# Altium schematic sheet Bluetooth.SchDoc
size A4
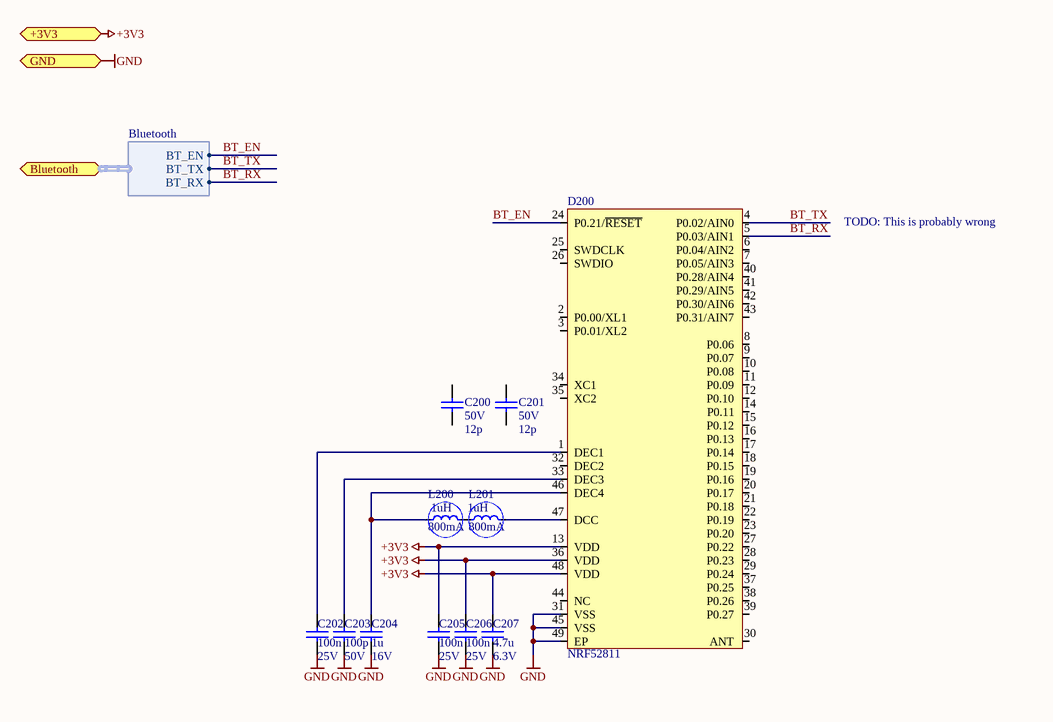
[diagram p0: Bluetooth.SchDoc]

## Parts
C200  value 12p  Value2: 50V  [SMD_CAP_0402]  (hidden comment: C_SMD_CER_12P_50V_2%_NP0_0402)
C201  value 12p  Value2: 50V  [SMD_CAP_0402]  (hidden comment: C_SMD_CER_12P_50V_2%_NP0_0402)
C202  value 100n  Value2: 25V  [SMD_CAP_0402]  (hidden comment: C_SMD_CER_100N_25V_10%_X7R_0402)
C203  value 100p  Value2: 50V  [SMD_CAP_0402]  (hidden comment: C_SMD_CER_100P_50V_5%_NP0_0402)
C204  value 1u  Value2: 16V  [SMD_CAP_0603]  (hidden comment: C_SMD_CER_1U_16V_10%_X7R_0603)
C205  value 100n  Value2: 25V  [SMD_CAP_0402]  (hidden comment: C_SMD_CER_100N_25V_10%_X7R_0402)
C206  value 100n  Value2: 25V  [SMD_CAP_0402]  (hidden comment: C_SMD_CER_100N_25V_10%_X7R_0402)
C207  value 4.7u  Value2: 6.3V  [SMD_CAP_0603]  (hidden comment: C_SMD_CER_4U7_6V3_10%_X5R_0603)
D200  Type: NRF52811  [SMD_VQFN-48_0.4_EP]  (hidden comment: D_NRF52811_VQFN-48)
L200  value 1uH  Value2: 800mA  [SMD_IND_1812]  (hidden comment: L_SMD_AIR_SHIELD_1U_0A8_20%_1812)
L201  value 1uH  Value2: 800mA  [SMD_IND_1812]  (hidden comment: L_SMD_AIR_SHIELD_1U_0A8_20%_1812)

## Ports
+3V3, Bluetooth (harness Bluetooth), GND

## Harnesses
Bluetooth: BT_TX, BT_RX, BT_EN

## Nets
+3V3: C205.2 C206.2 C207.2 D200.13(VDD) D200.36(VDD) D200.48(VDD) ; port +3V3
GND: C202.1 C203.1 C204.1 C205.1 C206.1 C207.1 D200.31(VSS) D200.45(VSS) D200.49(EP) ; port GND
BT_EN: D200.24(P0.21/~{RESET}) ; port Bluetooth.BT_EN
BT_RX: D200.5(P0.03/AIN1) ; port Bluetooth.BT_RX
BT_TX: D200.4(P0.02/AIN0) ; port Bluetooth.BT_TX
NetC202_2: C202.2 D200.1(DEC1)
NetC203_2: C203.2 D200.33(DEC3)
NetC204_2: C204.2 D200.46(DEC4) L200.1
NetD200_47: D200.47(DCC) L201.2
NetL200_2: L200.2 L201.1

Not connected (* = marked no-connect by the designer): C200 1 2; C201 1 2; D200 2(P0.00/XL1) 3(P0.01/XL2) 6(P0.04/AIN2) 7(P0.05/AIN3) 8(P0.06) 9(P0.07) 10(P0.08) 11(P0.09) 12(P0.10) 14(P0.11) 15(P0.12) 16(P0.13) 17(P0.14) 18(P0.15) 19(P0.16) 20(P0.17) 21(P0.18) 22(P0.19) 23(P0.20) 25(SWDCLK) 26(SWDIO) 27(P0.22) 28(P0.23) 29(P0.24) 30(ANT) 32(DEC2) 34(XC1) 35(XC2) 37(P0.25) 38(P0.26) 39(P0.27) 40(P0.28/AIN4) 41(P0.29/AIN5) 42(P0.30/AIN6) 43(P0.31/AIN7) 44(NC)

## Notes on the sheet
- TODO: This is probably wrong
- Title
- Size:
- Date:
- A4
- Number:
- Time:
- Revision:
- Sheet
- of
- File:

## Library data of the parts
C200 C201 = C_SMD_CER_12P_50V_2%_NP0_0402: 12pF ±2% 50V Ceramic Capacitor C0G, NP0 0402 (1005 Metric); Supplier - Digikey: 490-6197-1-ND
C202 C205 C206 = C_SMD_CER_100N_25V_10%_X7R_0402: 0.1µF ±10% 25V Ceramic Capacitor X7R 0402 (1005 Metric); Supplier - Digikey: 490-14603-1-ND
C204 = C_SMD_CER_1U_16V_10%_X7R_0603: 1µF ±10% 16V Ceramic Capacitor X7R 0603 (1608 Metric); Supplier - Digikey: 1276-1019-1-ND
D200 = D_NRF52811_VQFN-48: IC RF TxRx + MCU Bluetooth Bluetooth v5.1 2.4GHz 48-VFQFN Exposed Pad; Supplier - Digikey: 1490-1075-1-ND
L200 L201 = L_SMD_AIR_SHIELD_1U_0A8_20%_1812: SMD Coil; Supplier - Digikey: 445-6464-1-ND
C203 = C_SMD_CER_100P_50V_5%_NP0_0402: Supplier - Digikey: 311-1024-1-ND
C207 = C_SMD_CER_4U7_6V3_10%_X5R_0603: Supplier - Digikey: 1276-1045-1-ND